# EAGLE design Arduino-Pro-Mini-v10 (EAGLE 5.11)
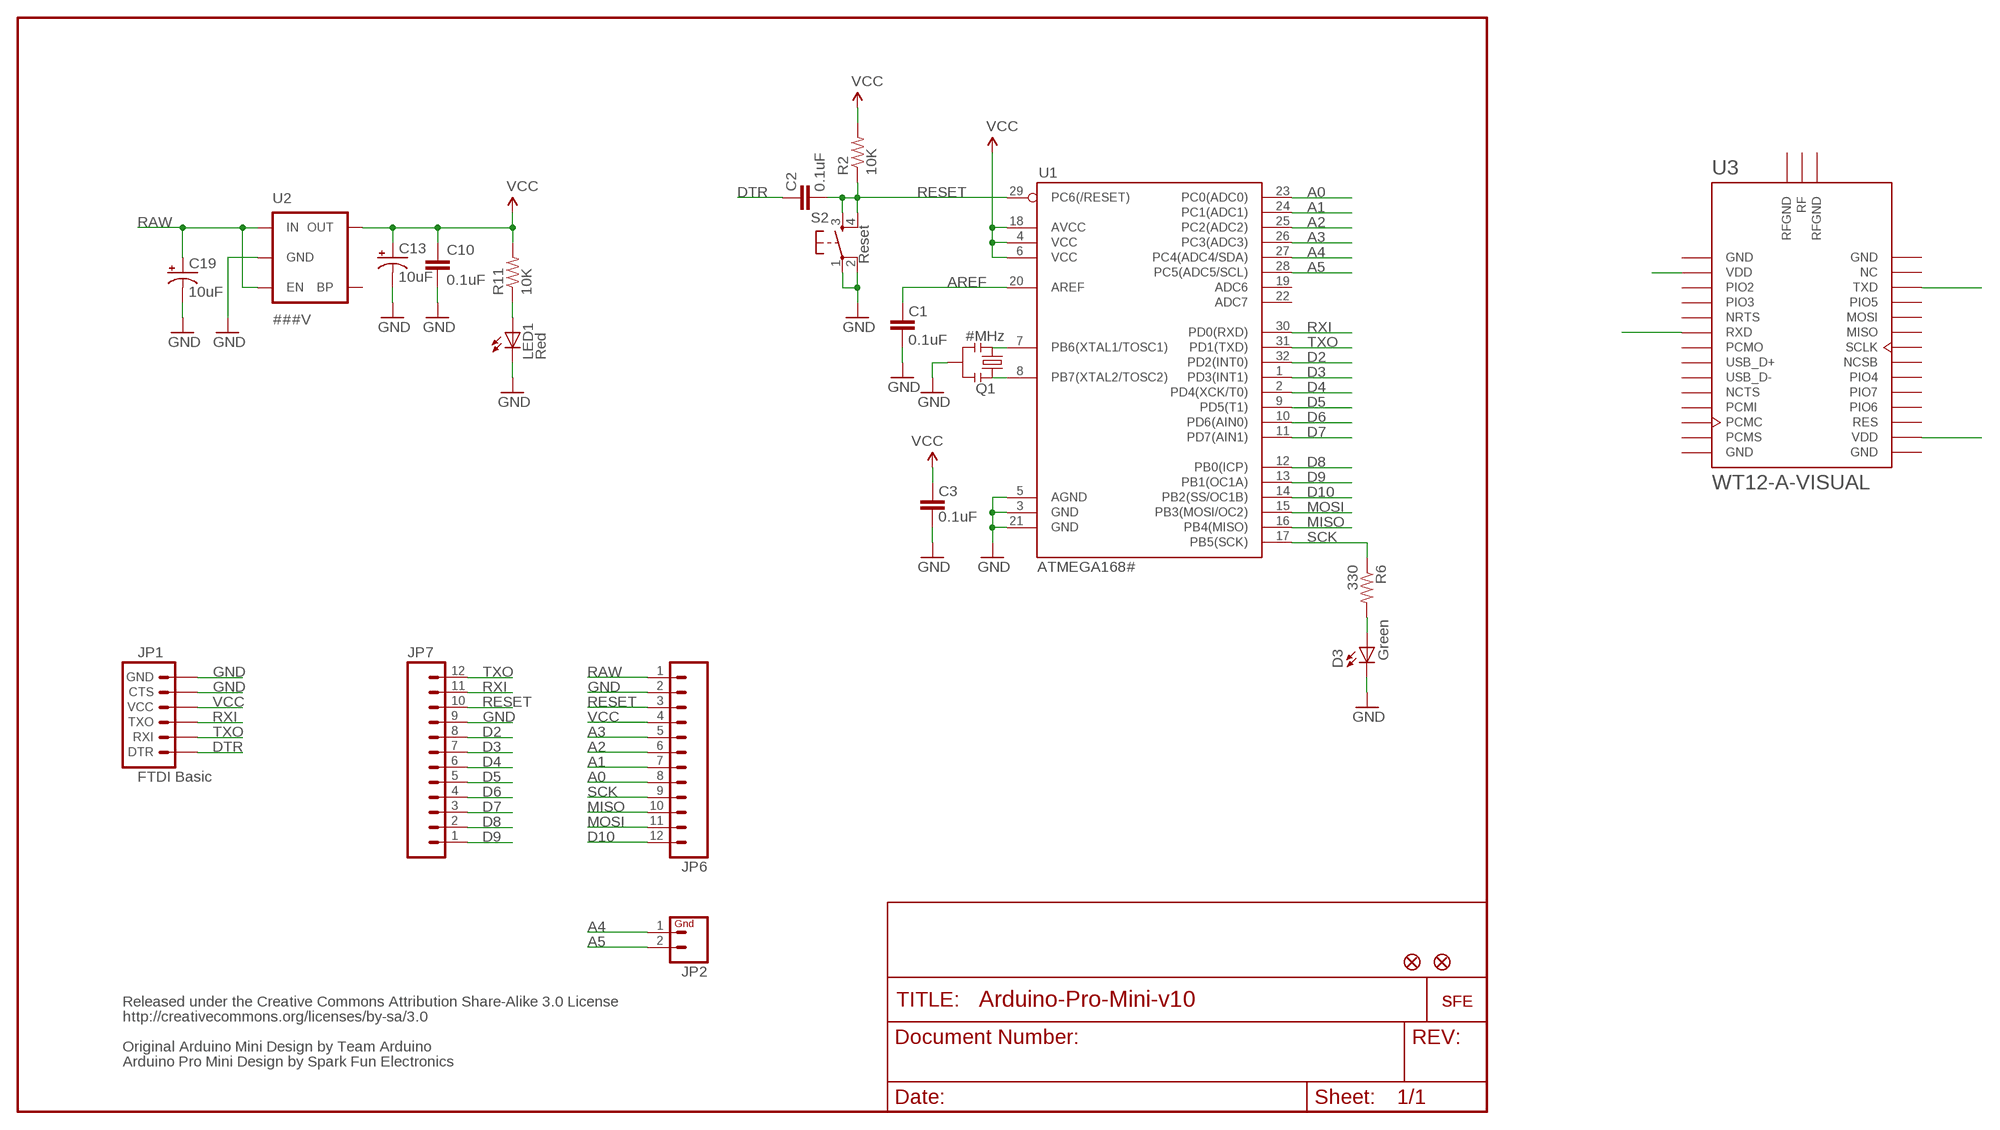
[diagram p0: schematic, sheet 1]

## Parts
C1  0.1uF  CAP0402  [C0402]
C2  0.1uF  CAP0402  [C0402]
C3  0.1uF  CAP0402  [C0402]
C10  0.1uF  CAP0402  [C0402]
C13  10uF  CAP_POL1206  [EIA3216]
C19  10uF  CAP_POL1206  [EIA3216]
D3  Green  LED0603  [LED-0603]
JP1  FTDI Basic  ARDUINO_SERIAL_PROGRAMPTH  [1X06]
JP2  M02PTH  [1X02]
JP6  M12PTH  [1X12]
JP7  M12PTH  [1X12]
LED1  Red  LED0603  [LED-0603]
Q1  #MHz  RESONATORSMD  [RESONATOR-SMD]
R2  10K  RESISTOR0402  [C0402]
R6  330  RESISTOR0402  [C0402]
R11  10K  RESISTOR0402  [C0402]
S2  Reset  TAC_SWITCHSND  [TACTILE_SWITCH_SMD]
U1  ATMEGA168#  ATMEGA168  [TQFP32-08]
U2  ###V  V_REG_LDOSMD  [SOT23-5]
U3  WT12-A-VISUAL  [WT12-A]
U$1  LOGO-SFESK  [SFE-LOGO-FLAME]
U$2  FIDUCIAL1X2  [FIDUCIAL-1X2]
U$4  FIDUCIAL1X2  [FIDUCIAL-1X2]
U$11  LOGO-SFENEW  [SFE-NEW-WEBLOGO]

## Nets
A0: JP6.8 U1.23(PC0(ADC0))
A1: JP6.7 U1.24(PC1(ADC1))
A2: JP6.6 U1.25(PC2(ADC2))
A3: JP6.5 U1.26(PC3(ADC3))
A4: JP2.1 U1.27(PC4(ADC4/SDA))
A5: JP2.2 U1.28(PC5(ADC5/SCL))
AREF: C1.2 U1.20(AREF)
D2: JP7.8 U1.32(PD2(INT0))
D3: JP7.7 U1.1(PD3(INT1))
D4: JP7.6 U1.2(PD4(XCK/T0))
D5: JP7.5 U1.9(PD5(T1))
D6: JP7.4 U1.10(PD6(AIN0))
D7: JP7.3 U1.11(PD7(AIN1))
D8: JP7.2 U1.12(PB0(ICP))
D9: JP7.1 U1.13(PB1(OC1A))
D10: JP6.12 U1.14(PB2(SS/OC1B))
DTR: C2.2 JP1.1(DTR)
GND [vcc]: C1.1 C3.1 C10.2 C13.C(-) C19.C(-) D3.C JP1.5(CTS) JP1.6(GND) JP6.2 JP7.9 LED1.C Q1.2 S2.1 S2.2 U1.3(GND) U1.5(AGND) U1.21(GND) U2.2(GND)
MISO: JP6.10 U1.16(PB4(MISO))
MOSI: JP6.11 U1.15(PB3(MOSI/OC2))
N$1: Q1.1 U1.8(PB7(XTAL2/TOSC2))
N$2: Q1.3 U1.7(PB6(XTAL1/TOSC1))
N$7: D3.A R6.2
N$38: LED1.A R11.1
RAW [vcc]: C19.A(+) JP6.1 U2.1(IN) U2.3(EN)
RESET: C2.1 JP6.3 JP7.10 R2.1 S2.3 S2.4 U1.29(PC6(/RESET))
RXI: JP1.3(TXO) JP7.11 U1.30(PD0(RXD)) U3.TXD
SCK: JP6.9 R6.1 U1.17(PB5(SCK))
TXO: JP1.2(RXI) JP7.12 U1.31(PD1(TXD)) U3.RXD
VCC: C3.2 C10.1 C13.A(+) JP1.4(VCC) JP6.4 R2.2 R11.2 U1.4(VCC) U1.6(VCC) U1.18(AVCC) U2.5(OUT) U3.VDD1(VDD) U3.VDD2(VDD)
Unconnected: U1.19(ADC6) U1.22(ADC7) U2.4(BP) U3.MISO U3.MOSI U3.NC U3.NCSB U3.NCTS U3.NRTS U3.PCMC U3.PCMI U3.PCMO U3.PCMS U3.PIO2 U3.PIO3 U3.PIO4 U3.PIO5 U3.PIO6 U3.PIO7 U3.RES U3.RF U3.RFGND1(RFGND) U3.RFGND2(RFGND) U3.SCLK U3.USB_D+ U3.USB_D-

## Notes on the sheet
- Released under the Creative Commons Attribution Share-Alike 3.0 License
- http://creativecommons.org/licenses/by-sa/3.0
- Original Arduino Mini Design by Team Arduino
- Arduino Pro Mini Design by Spark Fun Electronics

## Power pins joined to a net without a drawn wire
GND: U3.GND1(GND) U3.GND2(GND) U3.GND3(GND) U3.GND4(GND)

## Library data of the parts
C1-C3 C10 = SparkFun:CAP: Capacitor Standard 0603 ceramic capacitor, and 0.1" leaded capacitor.
C13 C19 = SparkFun:CAP_POL: Capacitor Polarized These are standard SMD and PTH capacitors. Normally 10uF, 47uF, and 100uF in electrolytic and tantalum varieties. Always verify the external diameter of the through hole cap, it varies with capacity, voltage, and manufacturer. The EIA devices should be standard.
D3 LED1 = SparkFun:LED: LEDs Standard schematic elements and footprints for 5mm, 3mm, 1206, and 0603 sized LEDs. 5mm - Spark Fun Electronics SKU : COM-00529 (and others)
JP1 = SparkFun:ARDUINO_SERIAL_PROGRAM
JP2 = SparkFun:M02: Header 2 Standard 2-pin 0.1" header. Use with straight break away headers (SKU : PRT-00116), right angle break away headers (PRT-00553), swiss pins (PRT-00743), machine pins (PRT-00117), and female headers (PRT-00115). Molex polarized connector foot print use with SKU : PRT-08233 with associated crimp pins and housings.
JP6 JP7 = SparkFun:M12: Header 12 Standard 12-pin 0.1" header. Use with straight break away headers (SKU : PRT-00116), right angle break away headers (PRT-00553), swiss pins (PRT-00743), machine pins (PRT-00117), and female headers (PRT-00115).
Q1 = SparkFun:RESONATOR: Resonator Small SMD resonator. This is the itty bitty 10/20MHz resonators with built in caps. CSTCE10M0G55 and CSTCE20M0V53. Footprint has been reviewed closely but hasn't been tested yet.
R2 R6 R11 = SparkFun:RESISTOR: Resistor Basic schematic elements and footprints for 0603, 1206, and PTH 1/10th watt (small) resistors.
S2 = SparkFun:TAC_SWITCH: Momentary Switch Button commonly used for reset or general input. Spark Fun Electronics SKU : COM-00097
U1 = SparkFun:ATMEGA168
U2 = SparkFun:V_REG_LDO: Voltage Regulator LDO Standard 150mA LDO voltage regulator in SOT-23 layout. Micrel part MIC5205. BP (by-pass) pin is used to lower output noise with 470pF cap.
U3 = sf-bluegiga:WT12-A-VISUAL: Class 2 Bluetooth 2.1 + EDR module, chip antenna and RF pins
U$1 U$11 = SparkFun:LOGO-SFE: Spark Fun Electronics PCB Logo This is the standard Spark Fun Electronics PCB logo.
U$2 U$4 = SparkFun:FIDUCIAL: Fiducial Alignment Points Various fiducial points for machine vision alignment.

## Net classes
0 default: width 0.203 mm
1 vcc: width 0.254 mm

## Board
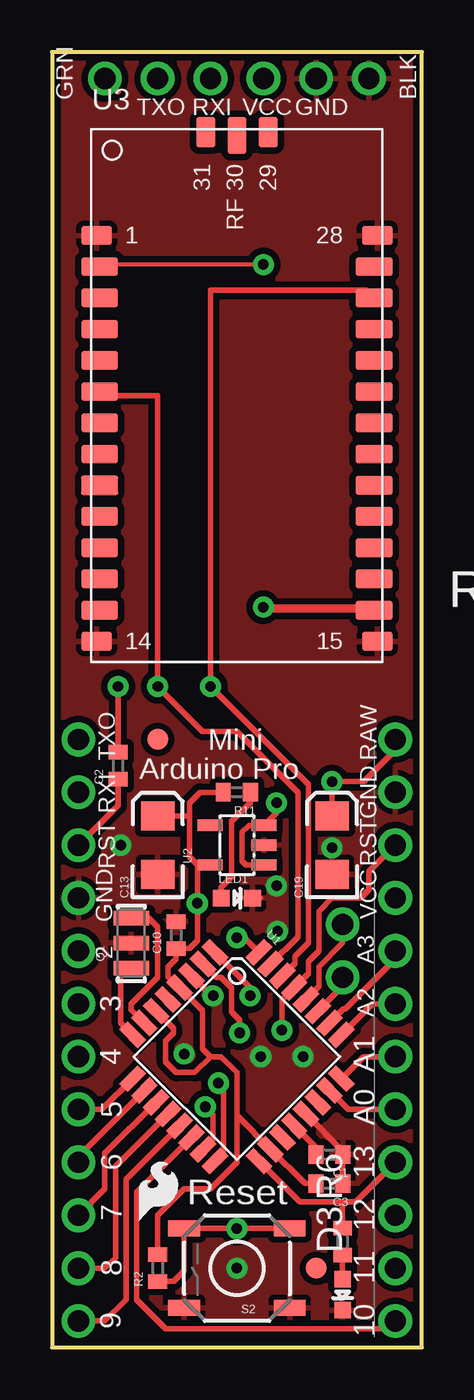
[diagram p1: board, top side]
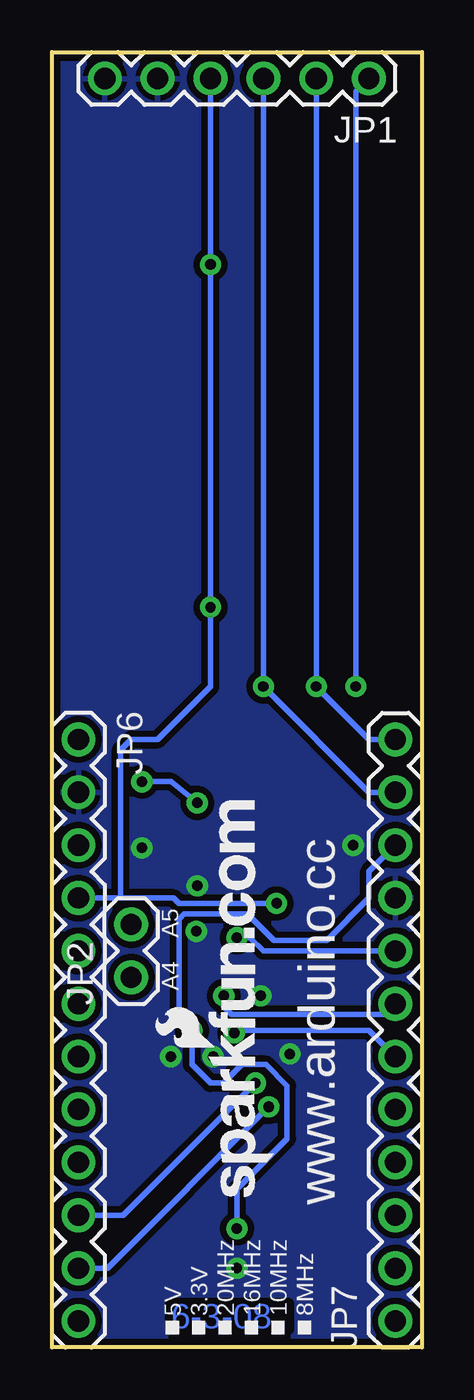
[diagram p2: board, bottom side, seen from below]

Size 17.78 x 62.23 mm. Coordinates in mm from the lower left corner, seen from the top.
Outline: 0,62.23 0,0 17.78,0 17.78,62.23 0,62.23
Copper layers (1*16): Top 0.035mm / dielectric 1.5mm / Bottom 0.035mm
Design rules "SparkFun *": minimum track width 8mil, minimum drill 20mil, track to track 8mil, track to pad 8mil, pad to pad 8mil, via to via 8mil, smd to smd 8mil, copper to edge 10mil, drill to drill 8mil, minimum pad ring 12mil, minimum via ring 10mil, stop-mask expansion 4mil, vias tented up to drill 20mil, thermal gap 10mil

### Footprints (pad centres in the part's own frame; a part is rotated, then mirrored left to right if it is on the bottom)
C0402 = smd 0.7 x 0.9: 1 -0.65,0; 2 0.65,0
EIA3216 = smd 1.4 x 1.6: A 1.4,0; C -1.4,0
LED-0603 = smd 0.8 x 0.8: A 0,-0.75; C 0,0.75
1X06 = drill 1.016 round: 1 0,0; 2 2.54,0; 3 5.08,0; 4 7.62,0; 5 10.16,0; 6 12.7,0
1X02 = drill 1.016 round: 1 0,0; 2 2.54,0
1X12 = drill 1.016 round: 1 0,0; 2 2.54,0; 3 5.08,0; 4 7.62,0; 5 10.16,0; 6 12.7,0; 7 15.24,0; 8 17.78,0; 9 20.32,0; 10 22.86,0; 11 25.4,0; 12 27.94,0
RESONATOR-SMD = smd 0.7 x 1.7: 1 -1.2,0; 2 0,0; 3 1.2,0
TACTILE_SWITCH_SMD = smd 1.524 x 0.762: 1 -2.54,1.905; 2 2.54,1.905; 3 -2.54,-1.905; 4 2.54,-1.905
TQFP32-08 = smd 1.27 x 0.559: 1 -4.293,2.8; 2 -4.293,2; 3 -4.293,1.2; 4 -4.293,0.4; 5 -4.293,-0.4; 6 -4.293,-1.2; 7 -4.293,-2; 8 -4.293,-2.8; 17 4.293,-2.8; 18 4.293,-2; 19 4.293,-1.2; 20 4.293,-0.4; 21 4.293,0.4; 22 4.293,1.2; 23 4.293,2; 24 4.293,2.8 | smd 0.559 x 1.27: 9 -2.8,-4.293; 10 -2,-4.293; 11 -1.2,-4.293; 12 -0.4,-4.293; 13 0.4,-4.293; 14 1.2,-4.293; 15 2,-4.293; 16 2.8,-4.293; 25 2.8,4.293; 26 2,4.293; 27 1.2,4.293; 28 0.4,4.293; 29 -0.4,4.293; 30 -1.2,4.293; 31 -2,4.293; 32 -2.8,4.293
SOT23-5 = smd 0.55 x 1.2: 1 -0.95,-1.3; 2 0,-1.3; 3 0.95,-1.3; 4 0.95,1.3; 5 -0.95,1.3
WT12-A = smd 1.478 x 0.914: GND1 -6.75,7.7; GND2 -6.75,-11.8; GND3 6.75,-11.8; GND4 6.75,7.7 | smd 1.778 x 0.914: MISO 6.6,0.2; MOSI 6.6,1.7; NC 6.6,6.2; NCSB 6.6,-2.8; NCTS -6.6,-5.8; NRTS -6.6,1.7; PCMC -6.6,-8.8; PCMI -6.6,-7.3; PCMO -6.6,-1.3; PCMS -6.6,-10.3; PIO2 -6.6,4.7; PIO3 -6.6,3.2; PIO4 6.6,-4.3; PIO5 6.6,3.2; PIO6 6.6,-7.3; PIO7 6.6,-5.8; RES 6.6,-8.8; RXD -6.6,0.2; SCLK 6.6,-1.3; TXD 6.6,4.7; USB_D+ -6.6,-2.8; USB_D- -6.6,-4.3; VDD1 -6.6,6.2; VDD2 6.6,-10.3 | smd 0.914 x 1.778: RF 0,12.5 | smd 0.914 x 1.478: RFGND1 1.5,12.65; RFGND2 -1.5,12.65
FIDUCIAL-1X2 = smd 1 x 1: 1 0,0

### Placement (x,y rotation side)
C1  13.34,9.27 180 top
C2  3.17,27.94 90 top
C3  13.34,7.87 180 top
C10  5.97,19.81 90 top
C13  5.08,24.13 90 top
C19  13.46,24.13 90 top
D3  13.97,2.54 180 top
JP1  2.54,60.96 180 bottom
JP2  13.97,17.78 90 bottom
JP6  16.51,29.21 270 bottom
JP7  1.27,1.27 90 bottom
LED1  8.89,21.59 270 top
Q1  3.81,19.43 90 top
R2  5.08,3.81 90 top
R6  13.97,5.08 270 top
R11  8.89,26.67 180 top
S2  8.89,3.81 180 top
U1  8.89,13.97 315 top
U2  8.89,24.13 90 top
U3  8.89,45.72 0 top
U$1  4.19,6.1 0 top
U$2  12.7,3.81 0 top
U$4  5.08,29.21 0 top
U$11  7.11,7.24 90 bottom

### Tracks (layer width: path | path; a pad name or v marks a point on that pad's centre or on a via)
A0
  Top 0.254: U1.23 14.26,11.43 JP6.8
A1
  Top 0.254: U1.24 14.96,13.97 JP6.7
A2
  Top 0.254: U1.25 15.39,16.51 JP6.6
A3
  Top 0.254: U1.26 14,16.26 14.1,16.26 16.51,18.67 16.51,18.76 16.51,18.8 JP6.5
A4
  Top 0.254: U1.27 13.97,17.35 JP2.1
A5
  Top 0.254: U1.28 12.83,17.34 12.83,18.29 13.97,19.43 JP2.2
AREF
  Top 0.254: C1.2 12.7,9.59 U1.20
D2  (via drill 0.51)
  Top 0.254: U1.32 9.25,19.68 v8.89,19.68
  Bottom 0.254: JP7.8 7.62,19.05 8.26,19.68 v8.89,19.68
D3  (via drill 0.51)
  Top 0.254: U1.1 9.53,17.3 v9.53,16.89
  Bottom 0.254: v9.53,16.89 9.53,16.38 9.14,16 1.78,16 JP7.7
D4  (via drill 0.51)
  Top 0.254: v9.02,15.11 9.02,15.75 8.64,16.13 8.64,17.27 8.13,17.78 7.91,17.78 U1.2
  Bottom 0.254: JP7.6 2.54,15.24 8.89,15.24 v9.02,15.11
D5
  Top 0.254: U1.9 2.39,11.43 JP7.5
D6
  Top 0.254: U1.10 1.27,9.18 JP7.4
D7
  Top 0.254: U1.11 2.54,9.32 2.54,7.62 JP7.3
D8
  Top 0.254: U1.12 3.05,8.69 3.05,4.32 2.54,3.81 JP7.2
D9
  Top 0.254: JP7.1 2.54,1.27 3.56,2.29 3.56,8.07 U1.13
D10
  Top 0.254: JP6.12 16.13,0.89 5.46,0.89 4.06,2.29 4.06,7.45 U1.14
DTR  (via drill 0.5)
  Top 0.254: C2.2 v3.17,31.75 | JP1.1 3.17,60.33
  Bottom 0.254: v3.17,31.75 3.17,60.33 JP1.1
GND  (via drill 0.51)
  Top 0.254: C3.1 13.97,7.87 13.97,9.26 C1.1 13.97,9.27 13.97,9.46 U1.21 | LED1.C 10.03,21.59 | U1.3 7.62,16.94 v7.75,16.89
  other vias: 12.06,13.97 10.03,13.97 8.89,3.81 3.3,24.13 10.85,19.99 10.79,22.17 6.35,14.1 13.46,24
  pour Top (isolate 0.305): 0,62.23 17.78,62.23 17.78,0 0,0
  pour Bottom (isolate 0.305): 0,62.23 17.78,62.23 17.78,0 0,0
MISO  (via drill 0.51)
  Top 0.254: U1.16 8.26,9.38 8.26,12.45 v8,12.7
  Bottom 0.254: v8,12.7 14.35,6.35 JP6.10
MOSI  (via drill 0.51)
  Top 0.254: U1.15 7.75,10 7.75,11.18 v7.37,11.56
  Bottom 0.254: JP6.11 15.11,3.81 v7.37,11.56
N$1
  Top 0.254: Q1.1 3.61,18.16 3.3,18.16 3.3,15.6 U1.8
N$2
  Top 0.254: U1.7 3.81,16.22 3.81,16.51 5.08,17.78 5.08,20.19 4.64,20.63 Q1.3
N$7
  Top 0.254: D3.A R6.2
N$38
  Top 0.254: R11.1 9.54,26.18 8.64,25.27 8.64,22.61 8.13,22.1 8.13,21.59 LED1.A
RAW  (via drill 0.51)
  Top 0.254: JP6.1 16.51,28.7 14.98,27.18 14.99,27.18 v13.46,27.18 C19.A | v10.79,26.16 10.79,25.68 U2.3 9.46,25.08 9.14,24.77 9.14,23.37 9.33,23.18 U2.1
  Bottom 0.254: v10.79,26.16 12.06,27.18 v13.46,27.18
RESET  (via drill 0.51)
  Top 0.254: R2.1 5.09,3.17 5.84,3.17 6.35,3.68 S2.4 v8.89,5.71 S2.3 | JP6.3 15.24,22.86 15.24,21.97 14.86,21.59 13.46,21.59 12.83,20.95 12.83,19.05 12.32,18.54 12.32,17.96 U1.29 11.05,16.7 v11.05,15.24 | C2.1 3.17,26.04 JP7.10
  Bottom 0.254: v8.89,5.71 8.89,7.62 6.48,10.03 6.48,12.57 7.49,13.59 8.64,13.59 9.53,12.7 10.16,12.7 11.05,13.59 v11.05,15.24 11.68,15.88 11.68,20.57 11.43,20.83 8.38,20.83 7.11,19.56 4.57,19.56 2.54,21.59 2.54,22.86 JP7.10
RXI  (via drill 0.5)
  Top 0.203: 7.7,31.67 7.72,31.7
  Top 0.254: U1.30 11.68,18.46 11.68,18.8 12.32,19.43 12.32,27.05 7.7,31.67 v7.62,31.75 7.62,50.8 15.11,50.8 U3.TXD
  Bottom 0.254: JP7.11 2.54,26.67 v7.62,31.75 JP1.3
SCK
  Top 0.254: 13.97,6.99 14.61,6.99 JP6.9 | 13.97,6.99 R6.1 | U1.17 11.91,6.99 13.97,6.99
TXO  (via drill 0.5)
  Top 0.254: U1.31 11.81,19.72 11.81,26.67 8.89,29.59 7.24,29.59 v5.08,31.75 5.08,45.72 2.49,45.72 U3.RXD
  Bottom 0.203: 4.85,31.52 4.88,31.5
  Bottom 0.254: JP7.12 2.54,29.21 4.85,31.52 v5.08,31.75 JP1.2
VCC  (via drill 0.5, 0.51)
  Top 0.203: v10.16,52.02 2.44,52.02 U3.VDD1
  Top 0.254: C13.A 6.6,25.53 | R11.2 7.11,26.67 6.6,26.16 6.6,25.53 | 8.94,11.1 U1.18 12.16,7.87 C3.2 | 8.94,11.1 8.89,11.14 | R2.2 5.08,6.35 6.35,7.62 7.62,7.62 8.89,8.89 8.89,11.05 | 8.89,11.05 8.94,11.1 | 7.62,13.97 7.24,14.35 7.24,16.19 U1.4 6.11,17.29 | 7.62,13.97 8.13,13.97 8.89,13.21 8.89,11.05 | 6.11,17.29 6.1,17.27 | 6.99,23.18 U2.5 | 6.11,17.29 5.59,17.81 5.59,18.29 5.97,18.67 C10.1 5.95,19.16 5.97,19.18 6.6,19.18 6.99,19.56 v6.99,21.34 6.99,23.18 | 6.99,23.18 6.6,23.56 6.6,25.53 | U1.6 5.84,15.32 5.84,15.11 5.46,14.73 5.46,13.72 5.97,13.21 6.86,13.21 7.62,13.97 | 15.24,35.56 v10.16,35.56 10.3,35.42 U3.VDD2
  Top 0.305: C10.1 5.84,19.18
  Bottom 0.254: 14.48,21.59 JP6.4 | 14.48,21.59 14.48,28.7 13.97,29.21 12.7,29.21 10.16,31.75 v10.16,35.56 v10.16,52.02 JP1.4 | 14.48,21.59 11.94,21.59 11.68,21.34 v6.99,21.34

### Text on the board
Bottom: 6-3-08
tPlace: GRN | BLK | TXO | RXI | VCC | GND | Released under the Creative Commons Attribution Share-Alike 3.0 License | Mini | TXO | RAW | Arduino Pro | RXI | GND | RST | RST | VCC | GND | 2 | A3 | 3 | A2 | 4 | A1 | 5 | A0 | 6 | 13 | Reset | 7 | 12 | 8 | 11 | 9 | 10 | http://creativecommons.org/licenses/by-sa/3.0
bPlace: A5 | A4 | www.arduino.cc | 8MHz | 10MHz | 16MHz | 20MHz | 3.3V | 5V
tValues: Tent Vias! | Arduino Wee v1.3